# Altium schematic sheet current_frontend.SchDoc: Current Sense Frontend
size A3; DocumentNumber: 1; SheetNumber: 2; SheetTotal: 4
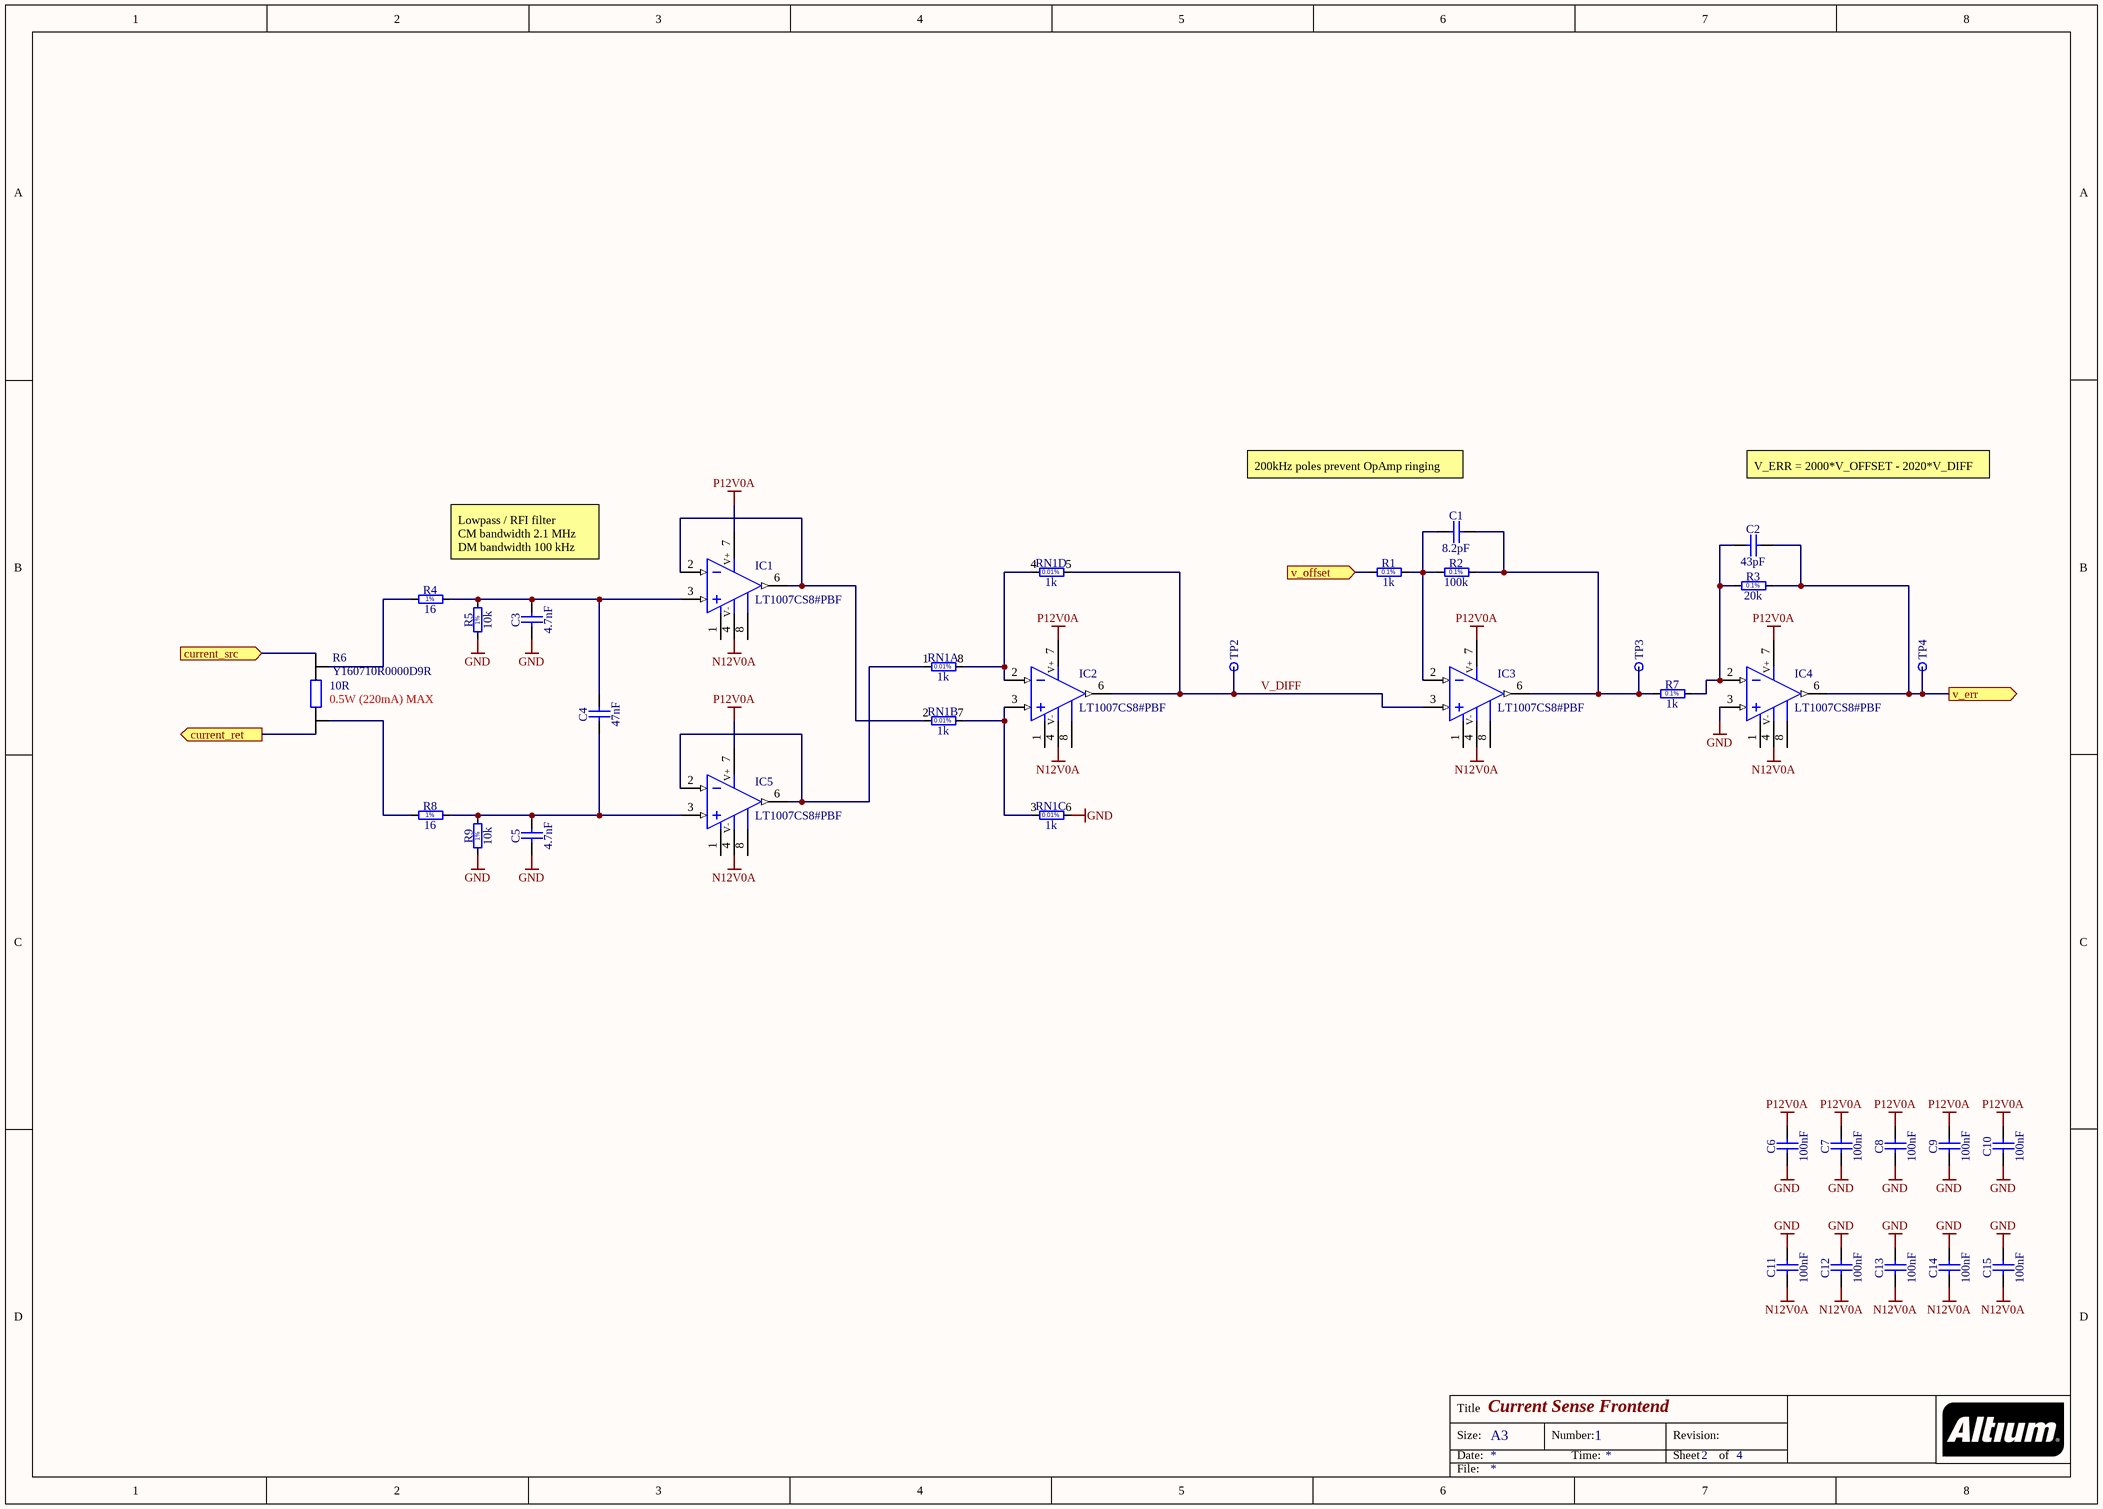
[diagram p0: current_frontend.SchDoc]

## Parts
C1  8.2pF  [CAPC1608X87N]
C2  43pF  [CAPC1608X87N]
C3  4.7nF  [CAPC2012X95N]
C4  47nF  [CAPC2012X135N]
C5  4.7nF  [CAPC2012X95N]
C6  100nF  [CAPC1608X87N]
C7  100nF  [CAPC1608X87N]
C8  100nF  [CAPC1608X87N]
C9  100nF  [CAPC1608X87N]
C10  100nF  [CAPC1608X87N]
C11  100nF  [CAPC1608X87N]
C12  100nF  [CAPC1608X87N]
C13  100nF  [CAPC1608X87N]
C14  100nF  [CAPC1608X87N]
C15  100nF  [CAPC1608X87N]
IC1  LT1007CS8#PBF  [SOIC127P600X175-8N]
IC2  LT1007CS8#PBF  [SOIC127P600X175-8N]
IC3  LT1007CS8#PBF  [SOIC127P600X175-8N]
IC4  LT1007CS8#PBF  [SOIC127P600X175-8N]
IC5  LT1007CS8#PBF  [SOIC127P600X175-8N]
R1  1k  [RESC1608X55N]
R2  100k  [RESC1608X55N]
R3  20k  [RESC1608X55N]
R4  16  [RESC1608X55N]
R5  10k  [RESC1608X55N]
R6  Y160710R0000D9R  [VCS1625Z]
R7  1k  [RESC1608X55N]
R8  16  [RESC1608X55N]
R9  10k  [RESC1608X55N]
RN1  1k  [SOP65P490X110-9N-R168X188]  (parts A,B,C,D of 4)
TP2  Test Point  [TPS127]  (value not drawn)
TP3  Test Point  [TPS127]  (value not drawn)
TP4  Test Point  [TPS127]  (value not drawn)

## Ports
current_ret (out), current_src (in), v_err (out), v_offset (in)

## Nets
GND: C3.1 C5.1 C6.1 C7.1 C8.1 C9.1 C10.1 C11.1 C12.1 C13.1 C14.1 C15.1 IC4.3(IN+) R5.1 R9.1 RN1.6 RN1.9(EP)
N12V0A: C11.2 C12.2 C13.2 C14.2 C15.2 IC1.4(V-) IC2.4(V-) IC3.4(V-) IC4.4(V-) IC5.4(V-)
P12V0A: C6.2 C7.2 C8.2 C9.2 C10.2 IC1.7(V+) IC2.7(V+) IC3.7(V+) IC4.7(V+) IC5.7(V+)
current_ret: R6.I1 ; port current_ret
current_src: R6.I2 ; port current_src
V_DIFF: IC2.6(OUT) IC3.3(IN+) RN1.5 TP2.1
v_err: C2.2 IC4.6(OUT) R3.2 TP4.1 ; port v_err
v_offset: R1.1 ; port v_offset
NetC1_1: C1.1 IC3.2(IN-) R1.2 R2.1
NetC1_2: C1.2 IC3.6(OUT) R2.2 R7.1 TP3.1
NetC2_1: C2.1 IC4.2(IN-) R3.1 R7.2
NetC3_2: C3.2 C4.2 IC1.3(IN+) R4.2 R5.2
NetC4_1: C4.1 C5.2 IC5.3(IN+) R8.2 R9.2
NetIC1_2: IC1.2(IN-) IC1.6(OUT) RN1.2
NetIC2_2: IC2.2(IN-) RN1.4 RN1.8
NetIC2_3: IC2.3(IN+) RN1.3 RN1.7
NetIC5_2: IC5.2(IN-) IC5.6(OUT) RN1.1
NetR4_1: R4.1 R6.E2
NetR6_E1: R6.E1 R8.1

Not connected (* = marked no-connect by the designer): IC1 1(OFFSET) 8(OFFSET); IC2 1(OFFSET) 8(OFFSET); IC3 1(OFFSET) 8(OFFSET); IC4 1(OFFSET) 8(OFFSET); IC5 1(OFFSET) 8(OFFSET)

## Notes on the sheet
- 200kHz poles prevent OpAmp ringing
- V_ERR = 2000*V_OFFSET - 2020*V_DIFF
- Lowpass / RFI filter
  CM bandwidth 2.1 MHz
  DM bandwidth 100 kHz
- (near R6) 10R
- (near R6) 0.5W (220mA) MAX
- Title
- Size:
- Date:
- A3
- Number:
- Time:
- Revision:
- Sheet
- of
- File:
- (in symbol R0603_1K_0.1%_0.063W_10PPM) 0.1%
- (in symbol R0603_10K_1%_0.1W_100PPM) 1%
- (in symbol R0603_16R_1%_0.1W_100PPM) 1%
- (in symbol R0603_20K_0.1%_0.063W_10PPM) 0.1%
- (in symbol R0603_100K_0.1%_0.063W_10PPM) 0.1%

## Library data of the parts
C1 = CC0603_8.2PF_50V_0.5PF_NP0: Non-polarised capacitor; Part Description: SMD Multilayer Chip Ceramic Capacitor; Manufacturer: GENERIC; Manufacturer1 Part Number: 223886715828; Voltage: 50V; TC: C0G/NP0; Tolerance: ±0.5pF; Part Number: CC0603_8.2PF_50V_0.5PF_NP0; Component Kind: Standard; Component Type: Standard; Pin Count: 2; Value: 8.2pF; Status: Preferred; Manufacturer Part Number: CC0603_8.2PF_50V_0.5PF_NP0; Case: 0603; Mounted: Yes; Socket: No; SMD: Yes; Sense: No; Manufacturer1 Example: PHYCOMP; Manufacturer1 ComponentHeight: 0.87mm; HelpURL: \\cern.ch\dfs\Applications\Altium\Datasheets\CC0603_NP0_PHYCOMP.pdf; Author: CERN DEM JLC; CreateDate: 03/12/2007; LatestRevisionDate: 03/12/2007
C2 = CC0603_43PF_50V_5%_C0G: Non-polarised capacitor; Part Description: SMD Multilayer Chip Ceramic Capacitor; Manufacturer: GENERIC; Manufacturer1 Part Number: C0603C430J5GACTU; Voltage: 50V; TC: C0G/NP0; Tolerance: ±5%; Part Number: CC0603_43PF_50V_5%_C0G; Component Kind: Standard; Component Type: Standard; Pin Count: 2; Value: 43pF; Status: Preferred; Manufacturer Part Number: CC0603_43PF_50V_5%_C0G; Case: 0603; Mounted: Yes; Socket: No; SMD: Yes; Sense: No; Manufacturer1 Example: KEMET; Manufacturer1 ComponentHeight: 0.87mm; HelpURL: \\cern.ch\dfs\Applications\Altium\Datasheets\CC0603_C0G_KEMET_(Commercial Grade).pdf; Author: CERN DEM MR; CreateDate: 28/06/2017; LatestRevisionDate: 28/06/2017
C3 C5 = CC0805_4.7NF_50V_5%_NP0: Non-polarised capacitor; Part Description: SMD Multilayer Chip Ceramic Capacitor; Manufacturer: GENERIC; Manufacturer1 Part Number: GRM2195C1H472JA01; Voltage: 50V; TC: C0G/NP0; Tolerance: ±5%; Part Number: CC0805_4.7NF_50V_5%_NP0; Component Kind: Standard; Component Type: Standard; Pin Count: 2; Value: 4.7nF; Status: None; Manufacturer Part Number: CC0805_4.7NF_50V_5%_NP0; Case: 0805; Mounted: Yes; Socket: No; SMD: Yes; Sense: No; Manufacturer1 Example: MURATA; Manufacturer1 ComponentHeight: 0.95mm; HelpURL: \\cern.ch\dfs\Applications\Altium\Datasheets\CC0805_MURATA_GRM2195C1H472JA01.pdf; Author: CERN DEM MR; CreateDate: 30/03/2016; LatestRevisionDate: 30/03/2016
C4 = CC0805_47NF_25V_5%_C0G: Non-polarised capacitor; Part Description: SMD Multilayer Chip Ceramic Capacitor; Manufacturer: GENERIC; Manufacturer1 Part Number: C0805C473J3GACTU; Voltage: 25V; TC: C0G/NP0; Tolerance: ±5%; Part Number: CC0805_47NF_25V_5%_C0G; Component Kind: Standard; Component Type: Standard; Pin Count: 2; Value: 47nF; Status: None; Manufacturer Part Number: CC0805_47NF_25V_5%_C0G; Case: 0805; Mounted: Yes; Socket: No; SMD: Yes; Sense: No; Manufacturer1 Example: KEMET; Manufacturer1 ComponentHeight: 1.4mm; HelpURL: \\cern.ch\dfs\Applications\Altium\Datasheets\CC0805_C0G_KEMET_(Commercial Grade).pdf; Author: CERN DEM JLC; CreateDate: 18/01/2011; LatestRevisionDate: 18/01/2011
C6-C15 = CC0603_100NF_50V_10%_X7R: Non-polarised capacitor; Part Description: SMD Multilayer Chip Ceramic Capacitor; Manufacturer: GENERIC; Manufacturer1 Part Number: 223858615649; Voltage: 50V; TC: X7R; Tolerance: ±10%; Part Number: CC0603_100NF_50V_10%_X7R; Component Kind: Standard; Component Type: Standard; Pin Count: 2; Value: 100nF; Status: Preferred; Manufacturer Part Number: CC0603_100NF_50V_10%_X7R; Case: 0603; Mounted: Yes; Socket: No; SMD: Yes; Sense: No; Manufacturer1 Example: PHYCOMP; Manufacturer1 ComponentHeight: 0.87mm; HelpURL: \\cern.ch\dfs\Applications\Altium\Datasheets\CC0603_X7R_PHYCOMP.pdf; Author: CERN DEM JLC; CreateDate: 03/12/2007; LatestRevisionDate: 03/12/2007
IC1-IC5 = LT1007CS8#PBF: Operational Amplifier with Offset 1-8; Part Description: Low Noise, High Speed Precision Operational Amplifier; Manufacturer: LINEAR TECHNOLOGY; PressFit: No; Bonding: No; Part Number: LT1007CS8#PBF; Component Kind: Standard; Component Type: Standard; Device: LT1007CS8#PBF; PackageDescription: SOIC 8, Pitch 1.27mm - Body 4x5mm, IPC Medium Density; Manufacturer Part Number: LT1007CS8#PBF; Pin Count: 7; Case: SOIC8; Mounted: Yes; Socket: No; SMD: Yes; Sense: No; ComponentHeight: 1.75mm; Author: CERN DEM JLC; HelpURL: \\cern.ch\dfs\Applications\Altium\Datasheets\LT1007CS8#PBF.pdf; CreateDate: 09/03/2011; LatestRevisionDate: 09/03/2011
R1 R7 = R0603_1K_0.1%_0.063W_10PPM: Resistor - 0.1%; Part Description: Thin Film Chip Resistor; Manufacturer: GENERIC; Manufacturer1 Part Number: RN73C1J1K0BTG; Power: 0.063W; TC: ±10ppm; PressFit: No; Part Number: R0603_1K_0.1%_0.063W_10PPM; Component Kind: Standard; Component Type: Standard; Pin Count: 2; Value: 1k; Status: Not Recommended; Tolerance: ±0.1%; Manufacturer Part Number: R0603_1K_0.1%_0.063W_10PPM; Case: 0603; Mounted: Yes; Sense: No; Socket: No; SMD: Yes; Manufacturer1 Example: TYCO HOLSWORTHY; Manufacturer1 ComponentHeight: 0.55mm; HelpURL: \\cern.ch\dfs\Applications\Altium\Datasheets\R0603_Tyco_RN73.pdf; Author: CERN DEM BC; CreateDate: 23/05/2016; LatestRevisionDate: 23/05/2016
R2 = R0603_100K_0.1%_0.063W_10PPM: Resistor - 0.1%; Part Description: Thin Film Chip Resistor; Manufacturer: GENERIC; Manufacturer1 Part Number: RN73C1J100KBTDF; Power: 0.063W; TC: ±10ppm; PressFit: No; Part Number: R0603_100K_0.1%_0.063W_10PPM; Component Kind: Standard; Component Type: Standard; Pin Count: 2; Value: 100k; Status: Not Recommended; Tolerance: ±0.1%; Manufacturer Part Number: R0603_100K_0.1%_0.063W_10PPM; Case: 0603; Mounted: Yes; Sense: No; Socket: No; SMD: Yes; Manufacturer1 Example: TYCO HOLSWORTHY; Manufacturer1 ComponentHeight: 0.55mm; HelpURL: \\cern.ch\dfs\Applications\Altium\Datasheets\R0603_Tyco_RN73.pdf; Author: CERN DEM JLC; CreateDate: 03/12/2007; LatestRevisionDate: 13/03/2008
R3 = R0603_20K_0.1%_0.063W_10PPM: Resistor - 0.1%; Part Description: Thin Film Chip Resistor; Manufacturer: GENERIC; Manufacturer1 Part Number: RN73C1J20KBTDF; Power: 0.063W; TC: ±10ppm; PressFit: No; Part Number: R0603_20K_0.1%_0.063W_10PPM; Component Kind: Standard; Component Type: Standard; Pin Count: 2; Value: 20k; Status: Not Recommended; Tolerance: ±0.1%; Manufacturer Part Number: R0603_20K_0.1%_0.063W_10PPM; Case: 0603; Mounted: Yes; Sense: No; Socket: No; SMD: Yes; Manufacturer1 Example: TYCO HOLSWORTHY; Manufacturer1 ComponentHeight: 0.5mm; HelpURL: \\cern.ch\dfs\Applications\Altium\Datasheets\R0603_Tyco_RN73.pdf; Author: CERN DEM JLC; CreateDate: 03/12/2007; LatestRevisionDate: 13/03/2008
R4 R8 = R0603_16R_1%_0.1W_100PPM: Resistor - 1%; Part Description: General Purpose Thick Film Chip Resistor; Manufacturer: GENERIC; Manufacturer1 Part Number: NRC06F16R0TRF; Power: 0.1W; TC: ±100ppm/°C; PressFit: No; Part Number: R0603_16R_1%_0.1W_100PPM; Component Kind: Standard; Component Type: Standard; Pin Count: 2; Value: 16; Status: Preferred; Tolerance: ±1%; Manufacturer Part Number: R0603_16R_1%_0.1W_100PPM; Case: 0603; Mounted: Yes; Sense: No; Socket: No; SMD: Yes; Manufacturer1 Example: NIC COMPONENT; Manufacturer1 ComponentHeight: 0.55mm; HelpURL: \\cern.ch\dfs\Applications\Altium\Datasheets\R0603_NIC_NRC.pdf; Author: CERN DEM JLC; CreateDate: 03/12/2007; LatestRevisionDate: 13/03/2008
R5 R9 = R0603_10K_1%_0.1W_100PPM: Resistor - 1%; Part Description: General Purpose Thick Film Chip Resistor; Manufacturer: GENERIC; Manufacturer1 Part Number: NRC06F1002TRF; Power: 0.1W; TC: ±100ppm/°C; PressFit: No; Part Number: R0603_10K_1%_0.1W_100PPM; Component Kind: Standard; Component Type: Standard; Pin Count: 2; Value: 10k; Status: Preferred; Tolerance: ±1%; Manufacturer Part Number: R0603_10K_1%_0.1W_100PPM; Case: 0603; Mounted: Yes; Sense: No; Socket: No; SMD: Yes; Manufacturer1 Example: NIC COMPONENT; Manufacturer1 ComponentHeight: 0.55mm; HelpURL: \\cern.ch\dfs\Applications\Altium\Datasheets\R0603_NIC_NRC.pdf; Author: CERN DEM JLC; CreateDate: 03/12/2007; LatestRevisionDate: 13/03/2008
R6 = Y160710R0000D9R: Current sense resistor, 10 Ohm, 500 mW, +-0.5%, 0.05ppm; Manufacturer: Vishay Foil Resistors; Supplier 1: Digi-Key; Device: Y160710R0000D9R; Manufacturer Part Number: Y160710R0000D9R
RN1 = RN_1K_1K_LINEAR_LT5400ACMS8E-4#PBF: DIL8 Resistor Network 4 Isolated Resistor 0.01% + Exposed Pad; Part Description: Quad Matched Resistor Network, Temperature Range  0°C to 70°C, LT5400 Series; Manufacturer: LINEAR TECHNOLOGY; Power: 4x0.8W; TC: ±0.2ppm/°C; PressFit: No; Part Number: RN_1K_1K_LINEAR_LT5400ACMS8E-4#PBF; Component Kind: Standard; Component Type: Standard; Pin Count: 9; Value: 1k; Sense: No; Tolerance: 0.01%; Manufacturer Part Number: LT5400ACMS8E-4#PBF; Case: MSOP8; Mounted: Yes; Socket: No; SMD: Yes; ComponentHeight: 1.1mm; HelpURL: \\cern.ch\dfs\Applications\Altium\Datasheets\RN_LINEAR_LT5400.pdf; Author: CERN DEM MR; CreateDate: 22/02/2016; LatestRevisionDate: 26/02/2018
TP2-TP4 = SMD_PAD_1.27X1.27MM: Part Description: 1.27mm x 1.27mm PCB Copper Area (SMD Test Point); Mounted: No; Part Number: SMD_PAD_1.27X1.27MM; Component Kind: Standard (No BOM); Component Type: Standard (No BOM); Pin Count: 1; Family: Test Point; Socket: No; SMD: Yes; Sense: No; Status: None; ComponentHeight: 0mm; HelpURL: Undefined; Author: CERN DEM JLC; CreateDate: 12/01/2008; LatestRevisionDate: 12/01/2008; PackageDescription: 1.27mm x 1.27mm PCB Copper Area (SMD Test Point)